# Altium schematic sheet power.SchDoc
size A4
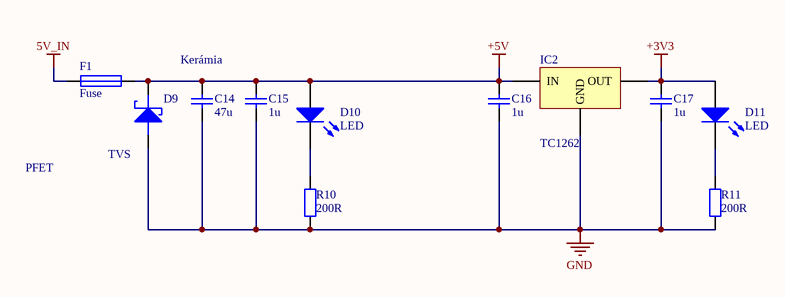
[diagram p0: power.SchDoc]

## Parts
C14  47u  [FP_0805_CAP_085]
C15  1u  [FP_0805_CAP_085]
C16  1u  [FP_0805_CAP_085]
C17  1u  [FP_0805_CAP_085]
D9  TVS  [FP_SMB]
D10  LED  [FP_0805_LED_GREEN]
D11  LED  [FP_0805_LED_GREEN]
F1  Fuse  [FP_MULTIFUSE]
IC2  TC1262  [FP_SOT223]
R10  200R  [FP_0805_RES]
R11  200R  [FP_0805_RES]

## Nets
5V_IN: F1.1
+3V3: C17.2 D11.1(A) IC2.3(OUT)
+5V: C14.2 C15.2 C16.2 D9.1(CATHODE) D10.1(A) F1.2 IC2.1(IN)
GND: C14.1 C15.1 C16.1 C17.1 D9.2(ANODE) IC2.2(GND) R10.1 R11.1
NetD10_2: D10.2(K) R10.2
NetD11_2: D11.2(K) R11.2

## Notes on the sheet
- Kerámia
- PFET

## Library data of the parts
C14 = CAP: Capacitor; Reference: 1003.2847; Supplier: Hestore; Value: 47u
C15-C17 = CAP: Capacitor; Reference: 2896565; Supplier: Farnell; Value: 1u
D9 = SCHOTTKY: TVS diode; Reference: 1827607; Supplier: Farnell
D10 D11 = LED: Typical RED GaAs LED; pin to pad: 1>A 2>K; Reference: 2099239; Name: LED, green; Supplier: Farnell
F1 = Fuse: Reference: 2383301; Name: PPTC Resettable Fuse; Supplier: Farnell
IC2 = TC1262: Fixed LDO Voltage Regulator; Reference: 1852183; Supplier: Farnell
R10 R11 = RES: Resistor; Reference: 2447602; Supplier: Farnell; Value: 200R